# Altium schematic sheet BalanceCar.SchDoc
size A
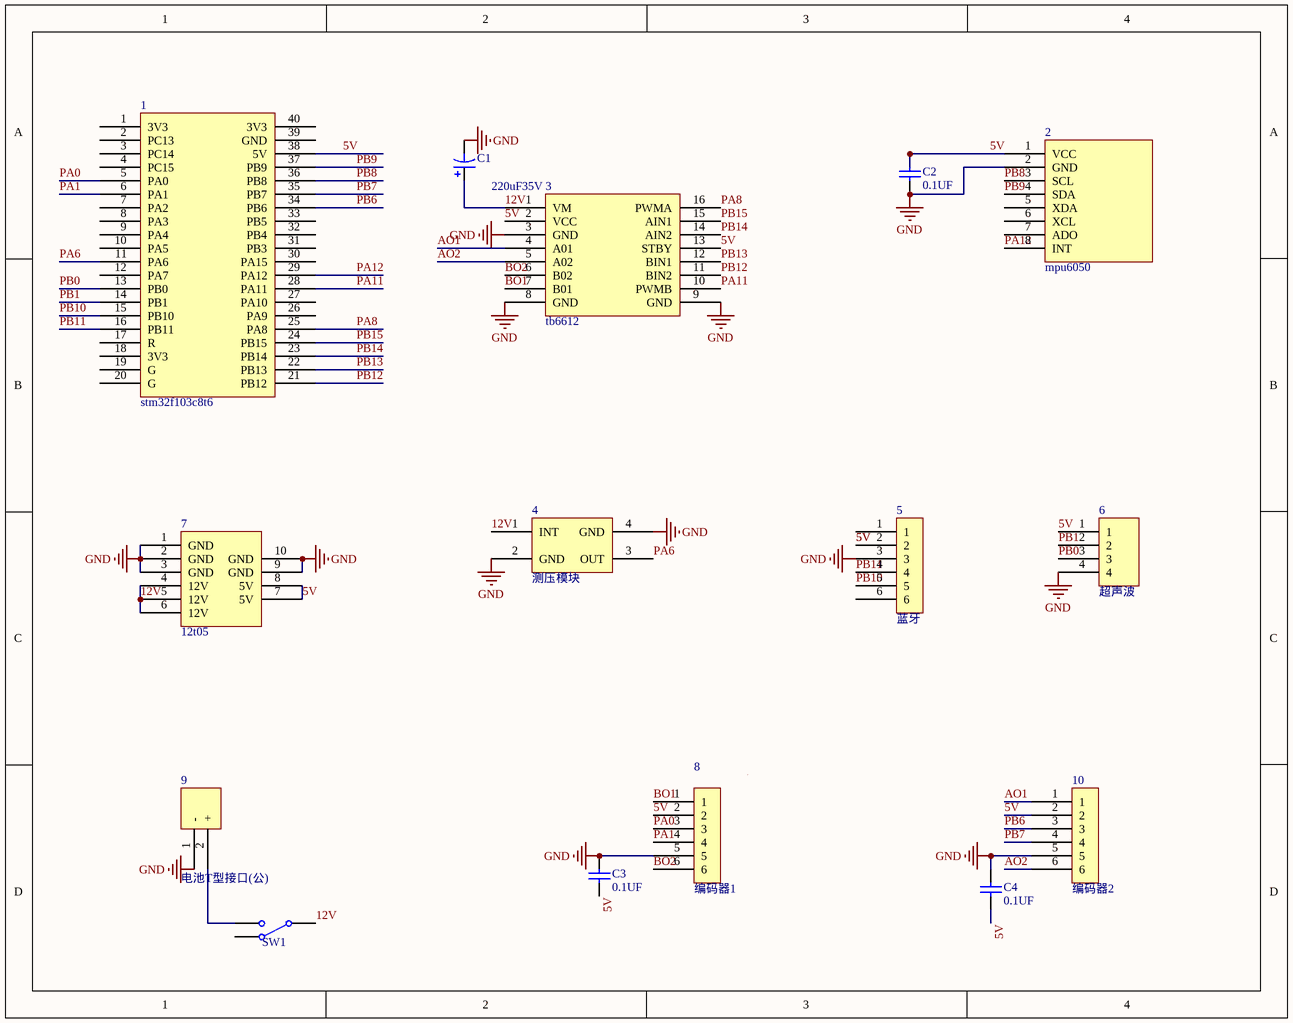
[diagram p0: BalanceCar.SchDoc]

## Parts
1  stm32f103c8t6  [STM32F103C8T6]
2  mpu6050  [6050new]
3  tb6612  [TB6612DIP]
4  测压模块  [DF - 3]
5  蓝牙  [HDR1X6 - XH弯]
6  超声波  [HDR1X4]
7  12t05  [稳压12T05]
8  编码器1  [1*6弯排母]
9  电池T型接口(公)  [T HEAD]
10  编码器2  [1*6弯排母]
C1  220uF35V  [CAP-820uF-6.3V]
C2  value 0.1UF  [Cap-CP]  (hidden comment: Capacitor)
C3  value 0.1UF  [Cap-CP]  (hidden comment: Capacitor)
C4  value 0.1UF  [Cap-CP]  (hidden comment: Capacitor)
SW1  Single-Pole, Double-Throw Switch  [SS12d11拨动电源开关]  (value not drawn)

## Nets
GND: 2.2(GND) 3.3(GND) 3.8(GND) 3.9(GND) 4.2(GND) 4.4(GND) 5.3 6.4 7.1(GND) 7.2(GND) 7.3(GND) 7.9(GND) 7.10(GND) 8.5 9.1(-) 10.5 C1.2 C2.2 C3.1 C4.2
5V: 1.38(5V) 2.1(VCC) 3.2(VCC) 3.13(STBY) 5.2 6.1 7.7(5V) 7.8(5V) 8.2 10.2 C2.1 C3.2 C4.1
12V: 3.1(VM) 4.1(INT) 7.4(12V) 7.5(12V) 7.6(12V) C1.1 SW1.1
AO1: 3.4(A01) 10.1
AO2: 3.5(A02) 10.6
BO1: 3.7(B01) 8.1
BO2: 3.6(B02) 8.6
PA0: 1.5(PA0) 8.3
PA1: 1.6(PA1) 8.4
PA6: 1.11(PA6) 4.3(OUT)
PA8: 1.25(PA8) 3.16(PWMA)
PA11: 1.28(PA11) 3.10(PWMB)
PA12: 1.29(PA12) 2.8(INT)
PB0: 1.13(PB0) 6.3
PB1: 1.14(PB1) 6.2
PB6: 1.34(PB6) 10.3
PB7: 1.35(PB7) 10.4
PB8: 1.36(PB8) 2.3(SCL)
PB9: 1.37(PB9) 2.4(SDA)
PB10: 1.15(PB10) 5.5
PB11: 1.16(PB11) 5.4
PB12: 1.21(PB12) 3.11(BIN2)
PB13: 1.22(PB13) 3.12(BIN1)
PB14: 1.23(PB14) 3.14(AIN2)
PB15: 1.24(PB15) 3.15(AIN1)
Net9_2: 9.2(+) SW1.2

Not connected (* = marked no-connect by the designer): 1 1(3V3) 2(PC13) 3(PC14) 4(PC15) 7(PA2) 8(PA3) 9(PA4) 10(PA5) 12(PA7) 17(R) 18(3V3) 19(G) 20(G) 26(PA9) 27(PA10) 30(PA15) 31(PB3) 32(PB4) 33(PB5) 39(GND) 40(3V3); 2 5(XDA) 6(XCL) 7(ADO); 5 1 6; SW1 3

## Library data of the parts
C1 = Cap Pol1: Polarized Capacitor (Radial); Published: 8-Jun-2000; LatestRevisionDate: 17-Jul-2002; LatestRevisionNote: Re-released for DXP Platform.; PackageReference: RB7.6-15; Publisher: Altium Limited; PackageDescription: Polarized Capacitor (Radial); 2 Leads
C2-C4 = Capacitor: SimulationGenericComponent: True
SW1 = SPDT SW: nodeUP_closed: 1; Rclosed: 1m; Ropen: 1Meg; SimulationGenericComponent: True